# EAGLE board EasyCheck_rev1 (EAGLE 9.4.0)
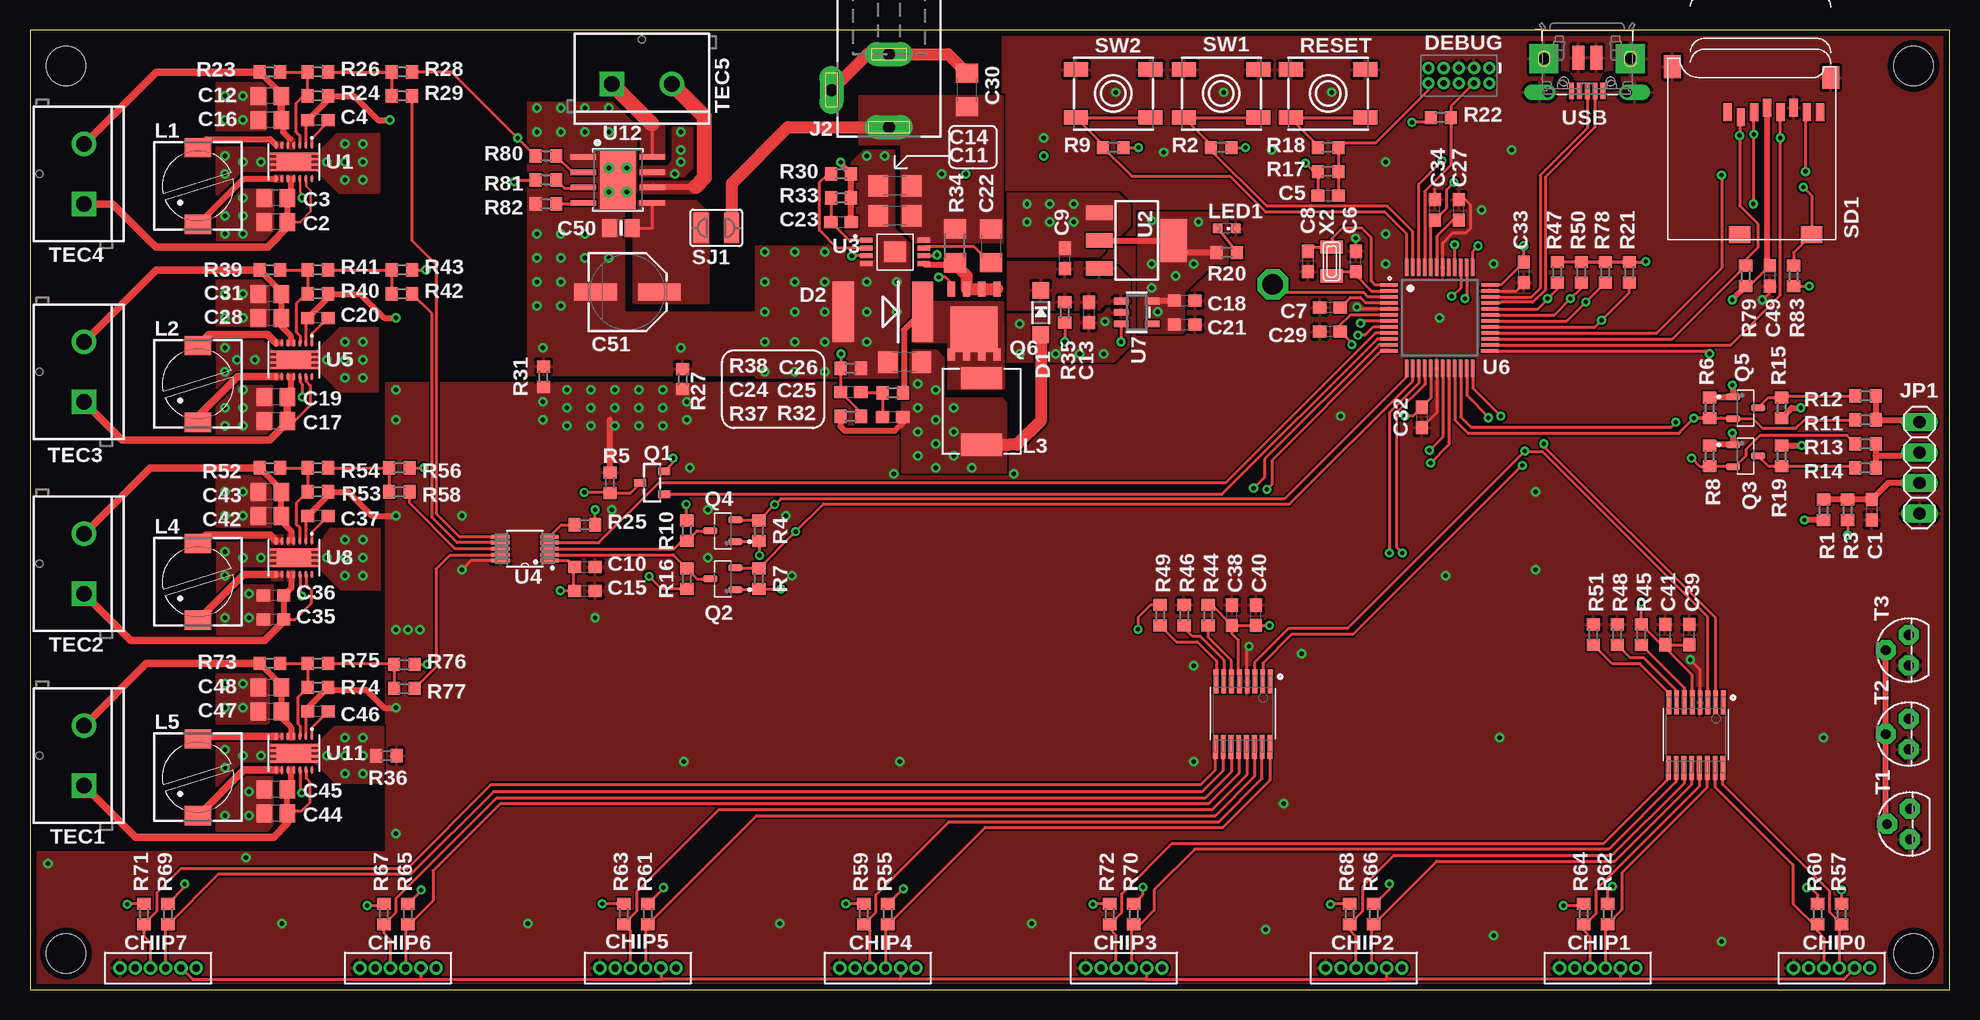
[diagram p2: board, top side]
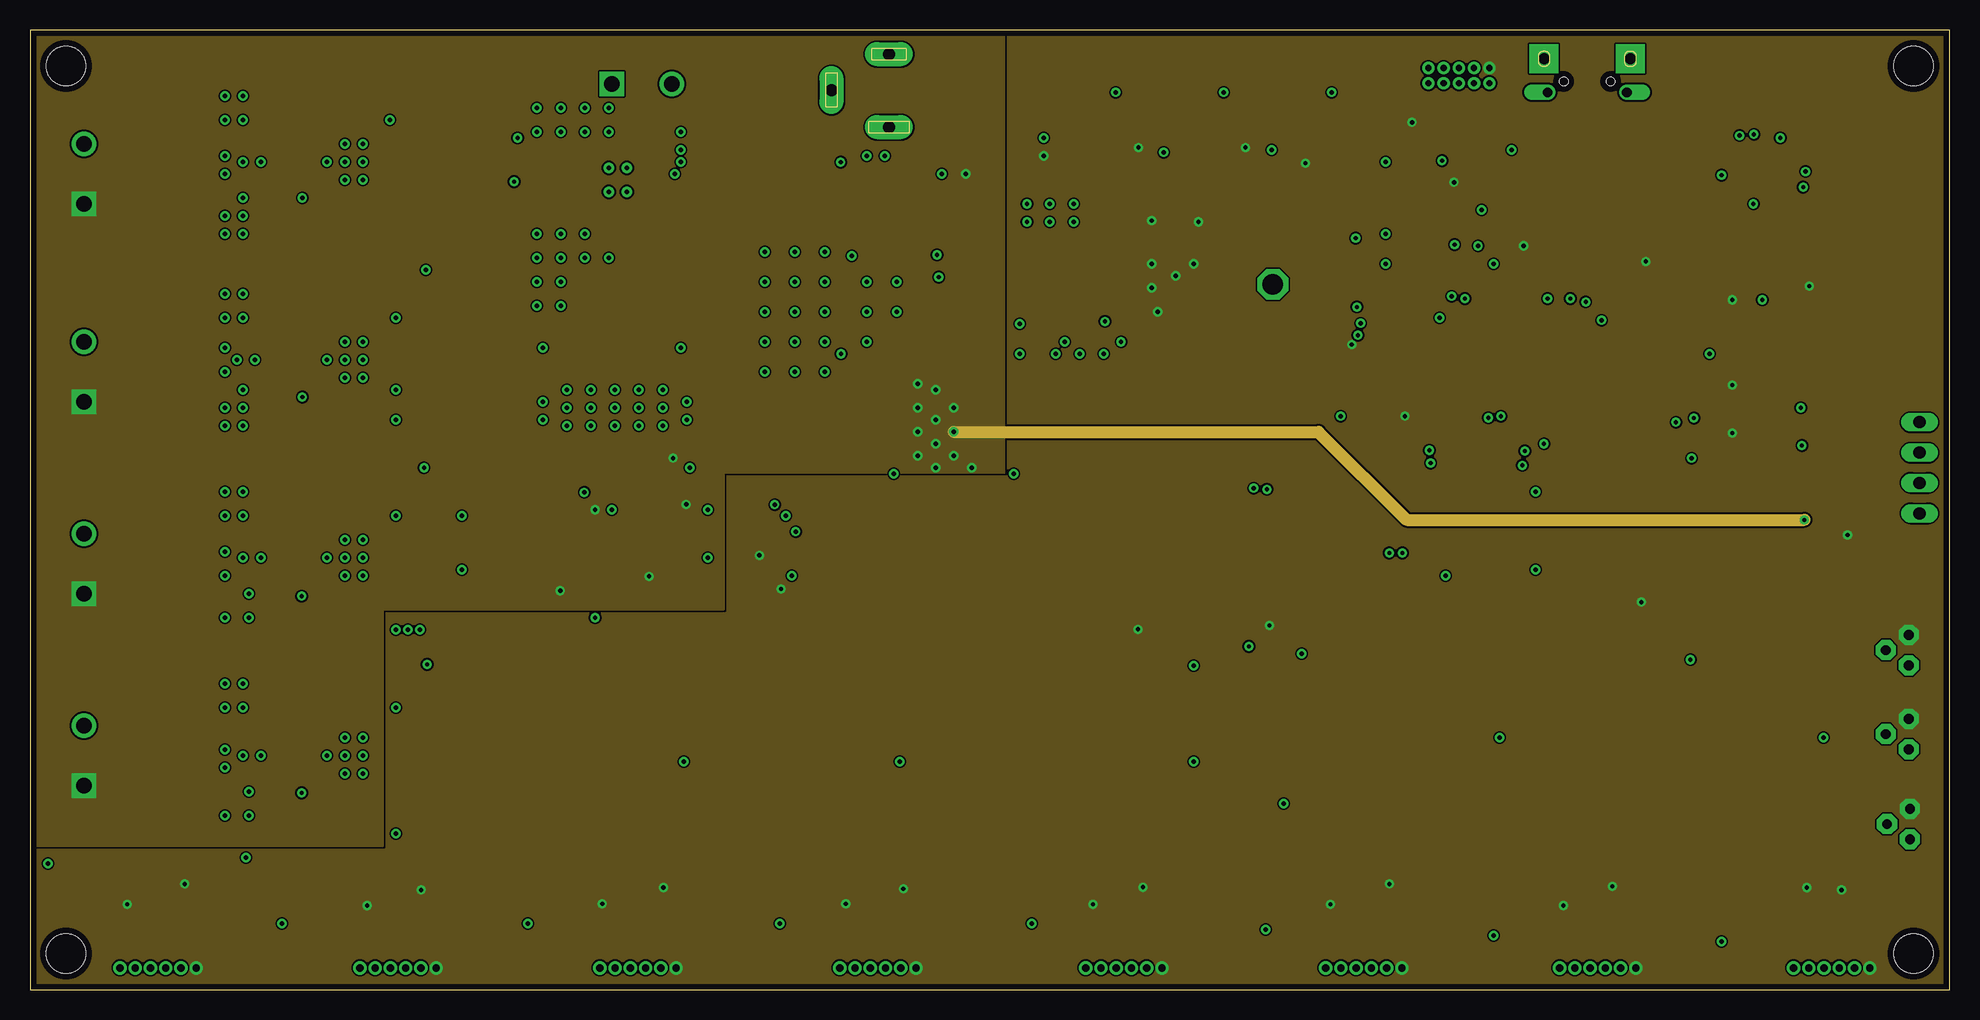
[diagram p3: board, inner layer Layer2]
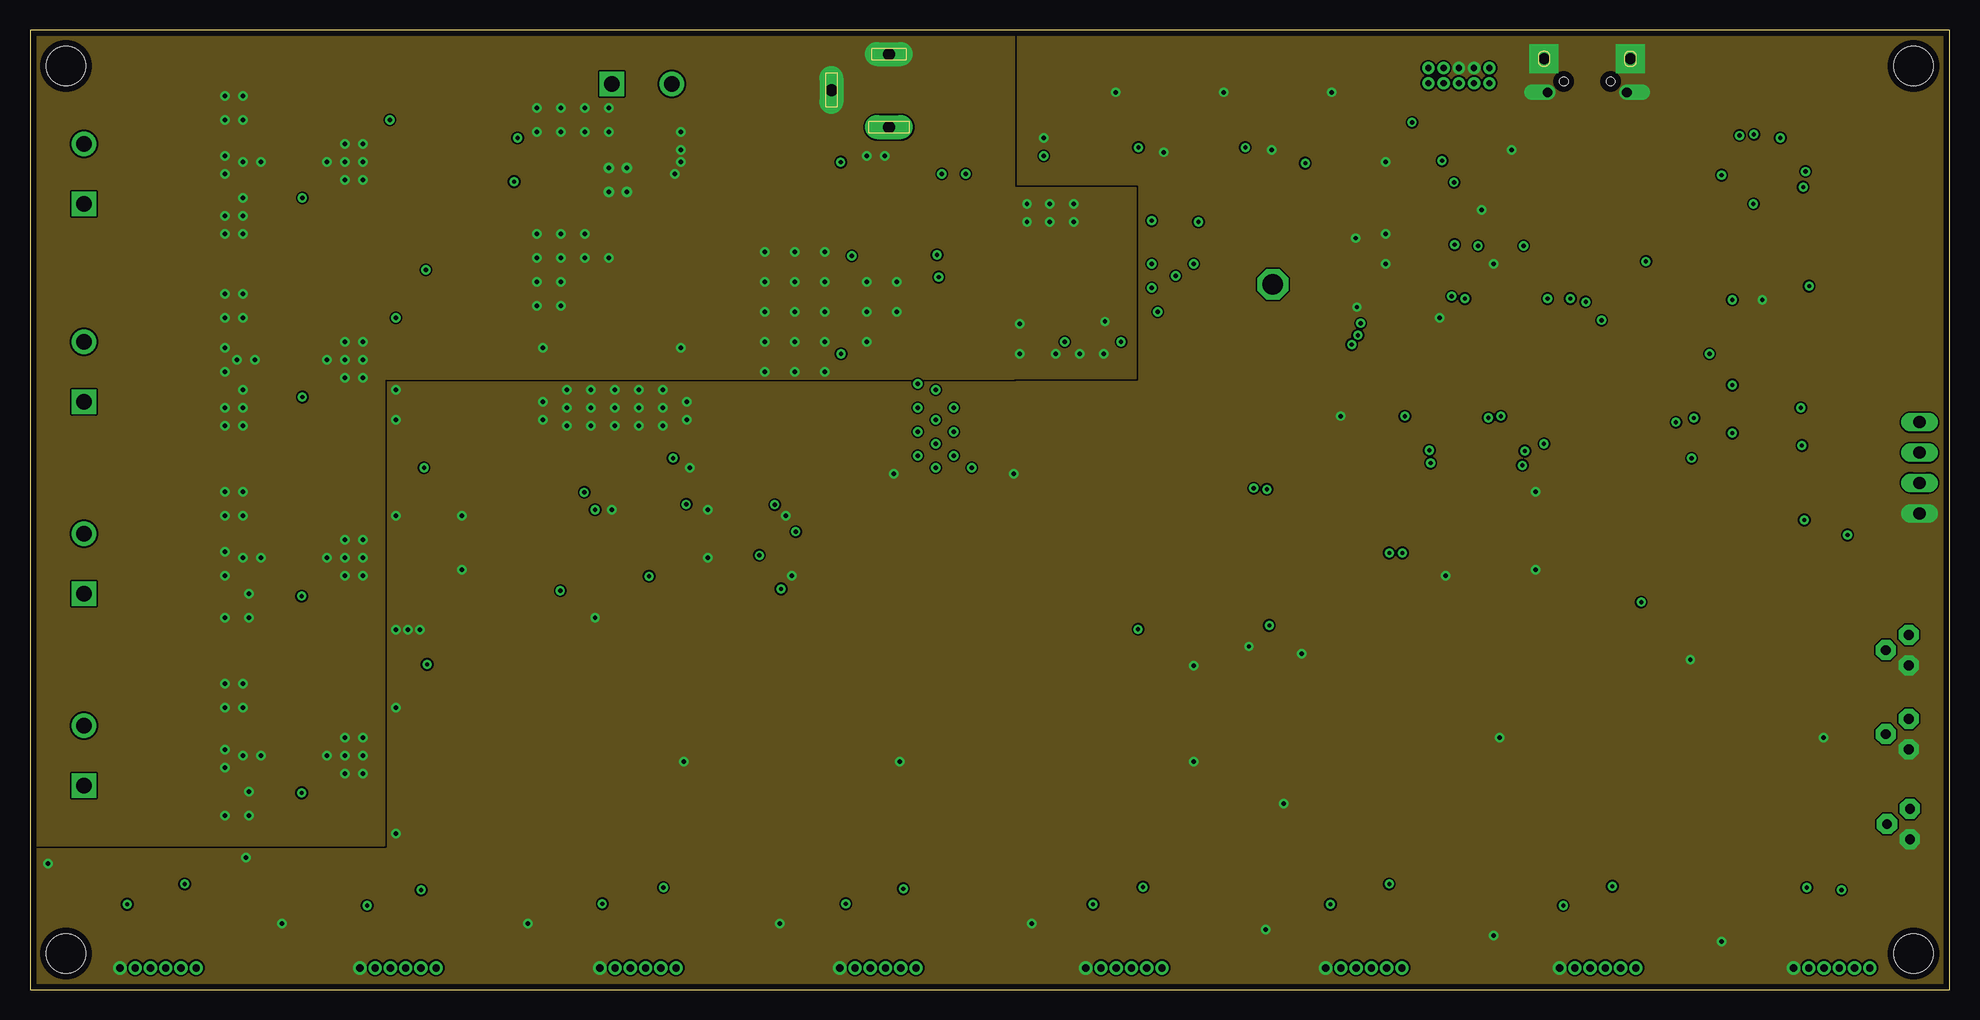
[diagram p4: board, inner layer Layer3]
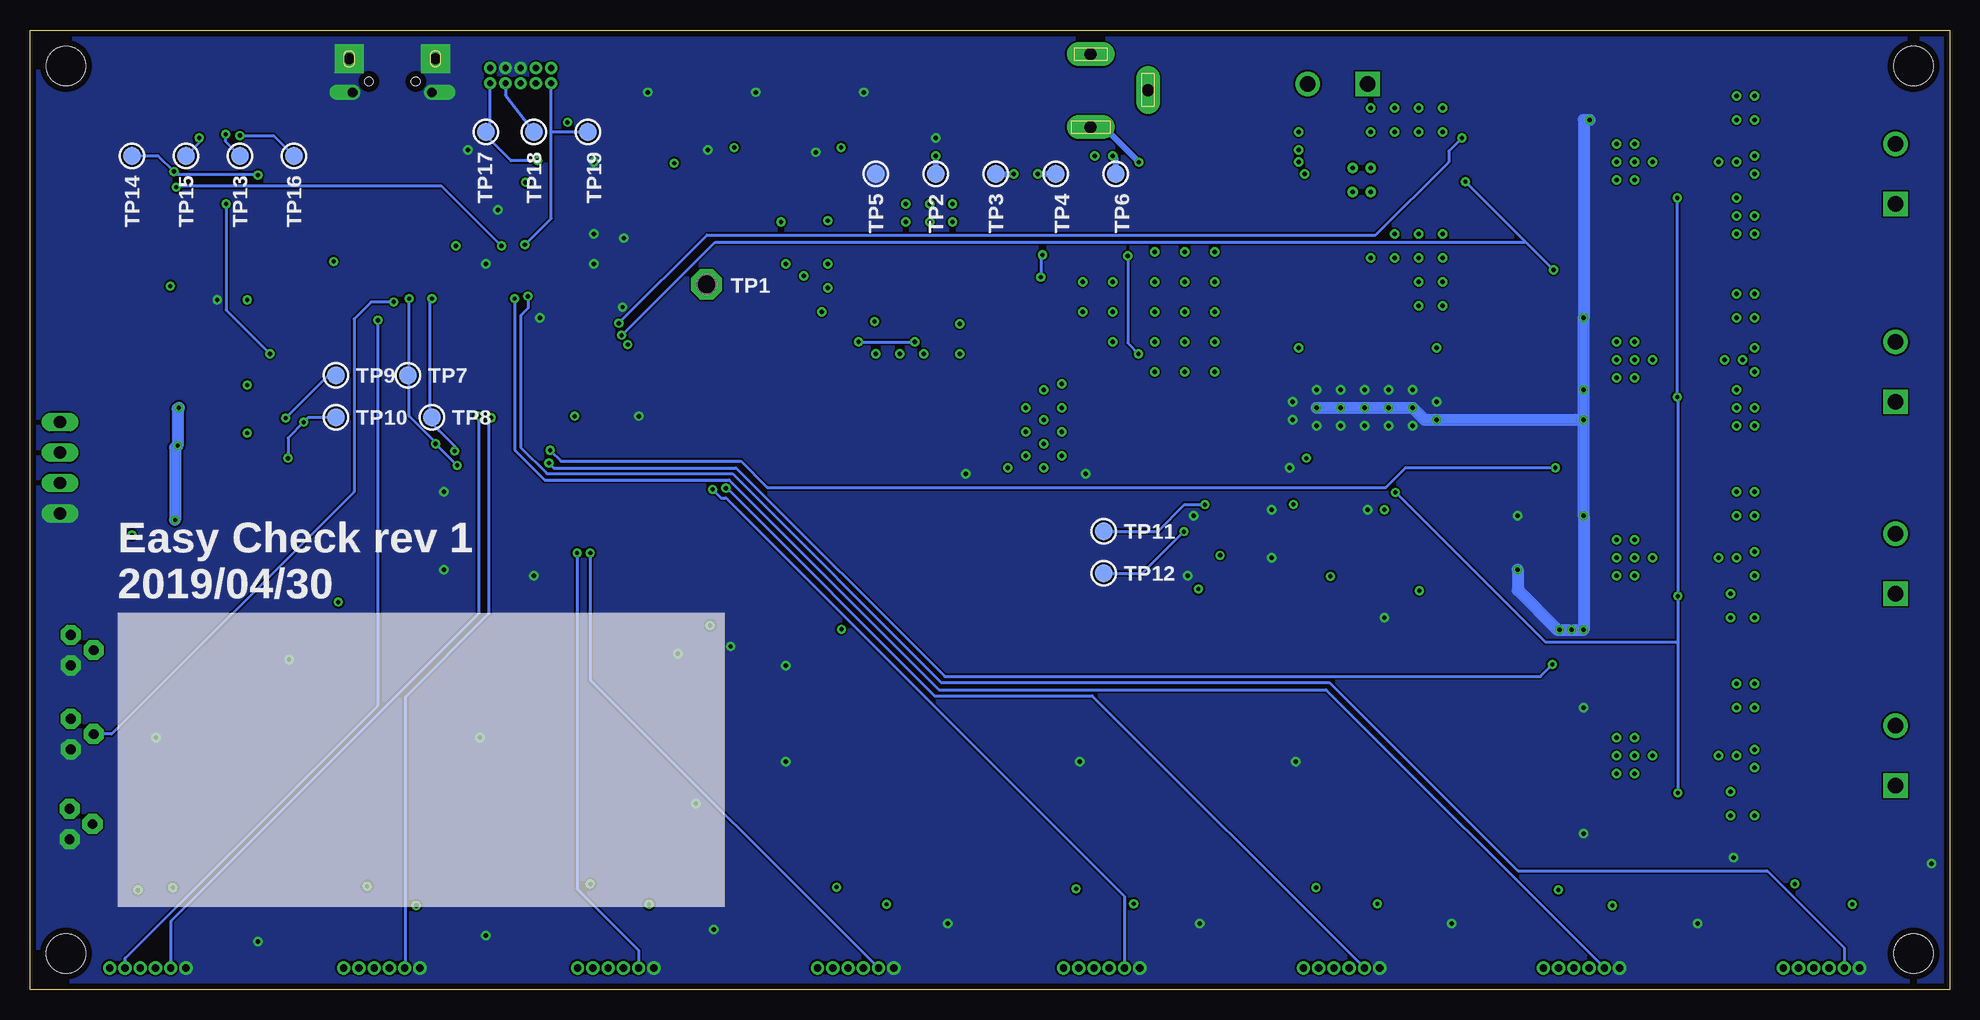
[diagram p5: board, bottom side, seen from below]

Size 160 x 80 mm. Coordinates in mm from the lower left corner, seen from the top.
Outline: 0,0 160,0 160,80 0,80 0,0
Copper layers (1+2*15+16): Top 0.035mm / dielectric 0.18mm / Layer2 0.035mm / dielectric 1.12mm / Layer3 0.035mm / dielectric 0.18mm / Bottom 0.035mm
Design rules "default *": minimum track width 6mil, minimum drill 0.35mm, track to track 6mil, track to pad 6mil, pad to pad 6mil, via to via 6mil, smd to smd 6mil, copper to edge 20mil, drill to drill 6mil, minimum pad ring 10mil, minimum via ring 8mil, stop-mask expansion 4mil, vias tented up to drill 0.4mm, thermal gap 10mil
Holes 3.3 mm at 3,3 3,77 157,3 157,77

## Footprints (pad centres in the part's own frame; a part is rotated, then mirrored left to right if it is on the bottom)
C0603 = smd 1.1 x 1: 1 -0.85,0; 2 0.85,0
C0805 = smd 1.3 x 1.5: 1 -0.95,0; 2 0.95,0
0603-NO = smd 1.1 x 1: 1 -0.85,0; 2 0.85,0
C1206 = smd 1.6 x 1.8: 1 -1.4,0; 2 1.4,0
0805-NO = smd 1.24 x 1.5: 1 -0.95,0; 2 0.95,0
PANASONIC_D = smd 3.556 x 1.4: + 2.654,0; - -2.654,0
6X1PIN_1.27 = drill 0.6: 1 0,0; 2 1.27,0; 3 2.54,0; 4 3.81,0; 5 5.08,0; 6 6.35,0
MICROBUILDER_SOD-123 = smd 1.4 x 1.4: A 1.85,0; C -1.85,0
SK104 = smd 1.778 x 5.08: 1 -3.302,0; 2 3.302,0
2X5-PTH-1.27MM = drill 0.508 pad 1: 1 -2.54,-0.635; 2 -2.54,0.635; 3 -1.27,-0.635; 4 -1.27,0.635; 5 0,-0.635; 6 0,0.635; 7 1.27,-0.635; 8 1.27,0.635; 9 2.54,-0.635; 10 2.54,0.635
DCJ0303 = drill 1 pad 2 long: 1 0,3.1; 2 4.8,0; 3 0,-3
1X04 = drill 1.016 long: 1 -3.81,0; 2 -1.27,0; 3 1.27,0; 4 3.81,0
PIS2816 = smd 2.2 x 1.6: 1 0,3.2; 2 0,-3.2
SPM6530T-4R7M = smd 1.85 x 3.4: 1 -2.775,0; 2 2.775,0
CHIPLED_0603 = smd 0.8 x 0.8: A 0,-0.75; C 0,0.75
MICROBUILDER_SOT23-R = smd 0.635 x 1.016: 1 -0.95,-1; 2 0.95,-1; 3 0,1
SOT91P240X110-3N = smd 1.18 x 0.61: 1 -1.025,0.915; 2 -1.025,-0.915; 3 1.025,0
SI7465 = smd 1.27 x 0.61: 1 0,1.905; 2 0,0.635; 3 0,-0.635; 4 0,-1.905 | smd 1.02 x 0.61: 5 5.465,-1.905; 6 5.465,-0.635; 7 5.465,0.635; 8 5.465,1.905 | smd 3.81 x 3.91: 9 3.36,0
R0603 = smd 1 x 1.1: 1 -0.85,0; 2 0.85,0
R1206 = smd 1.6 x 1.803: 1 -1.422,0; 2 1.422,0
MICROBUILDER_EVQ-Q2_SMALLER = smd 2 x 1.2: A -3.1,-2; A' 3.1,-2; B -3.1,2; B' 3.1,2
MICROSD = smd 0.7 x 1.5: 1 9,-10.64; 2 7.9,-10.24; 3 6.8,-10.64; 4 5.7,-11.04; 5 4.6,-10.64; 6 3.5,-11.04; 7 2.4,-10.64; 8 1.3,-10.64 | smd 1.8 x 1.4: CD1 2,-0.44; CD2 8,-0.44 | smd 1.4 x 1.9: MT1 0.4,-13.54; MT2 13.6,-14.44
SJW = smd 1.27 x 2.54: 1 -1.27,0; 2 1.27,0
TO92 = drill 0.813 pad 1.676 octagon: 1 -1.27,0; 2 0,1.905; 3 1.27,0
SPARKFUN-CONNECTORS_SCREWTERMINAL-5MM-2$1 = drill 1.3 pad 2.032 square: 1 0,0 | drill 1.3 pad 2.032: 2 5,0
P1-17 = drill 1.702 pad 2.54 octagon: TP 0,0
MICROBUILDER_TESTPOINT_ROUND_1.5MM = smd 1.5 x 1.5: P$1 0,0
QFN14-3X4MM = smd 0.6 x 0.24: 1 -1.4,1.5; 2 -1.4,1; 3 -1.4,0.5; 4 -1.4,0; 5 -1.4,-0.5; 6 -1.4,-1; 7 -1.4,-1.5; 8 1.4,-1.5; 9 1.4,-1; 10 1.4,-0.5; 11 1.4,0; 12 1.4,0.5; 13 1.4,1; 14 1.4,1.5 | smd 1.58 x 2.85: 15 0,0 | smd 0.2 x 0.575: 16 -0.69,1.712; 17 -0.23,1.712; 18 0.23,1.712; 19 0.69,1.712; 20 0.69,-1.712; 21 0.23,-1.712; 22 -0.23,-1.712; 23 -0.69,-1.712
GEN_COMP_SOT223 = smd 1.219 x 2.235: 1 -2.311,-3.099; 2 0,-3.099; 3 2.311,-3.099 | smd 3.6 x 2.2: 4 0,3.099
LM5085 = smd 0.41 x 1.02: 1 -0.975,-2.4; 2 -0.325,-2.4; 3 0.325,-2.4; 4 0.975,-2.4; 5 0.975,2.4; 6 0.325,2.4; 7 -0.325,2.4; 8 -0.975,2.4 | smd 1.73 x 1.85: 9 0,0
SOP50P490X110-10N = smd 1.524 x 0.33: 1 -2.032,0.991; 2 -2.032,0.508; 3 -2.032,0; 4 -2.032,-0.508; 5 -2.032,-0.991; 6 2.032,-0.991; 7 2.032,-0.508; 8 2.032,0; 9 2.032,0.508; 10 2.032,0.991
QFP50P900X900X120-48N = smd 1.45 x 0.3: 1 -4.2,2.75; 2 -4.2,2.25; 3 -4.2,1.75; 4 -4.2,1.25; 5 -4.2,0.75; 6 -4.2,0.25; 7 -4.2,-0.25; 8 -4.2,-0.75; 9 -4.2,-1.25; 10 -4.2,-1.75; 11 -4.2,-2.25; 12 -4.2,-2.75; 25 4.17,-2.75; 26 4.2,-2.25; 27 4.2,-1.75; 28 4.2,-1.25; 29 4.2,-0.75; 30 4.2,-0.25; 31 4.2,0.25; 32 4.2,0.75; 33 4.2,1.25; 34 4.2,1.75; 35 4.2,2.25; 36 4.2,2.75 | smd 0.3 x 1.45: 13 -2.75,-4.2; 14 -2.25,-4.2; 15 -1.75,-4.2; 16 -1.25,-4.2; 17 -0.75,-4.2; 18 -0.25,-4.2; 19 0.25,-4.2; 20 0.75,-4.2; 21 1.25,-4.2; 22 1.75,-4.2; 23 2.25,-4.2; 24 2.75,-4.2; 37 2.75,4.2; 38 2.25,4.2; 39 1.75,4.2; 40 1.25,4.2; 41 0.75,4.2; 42 0.25,4.2; 43 -0.25,4.2; 44 -0.75,4.2; 45 -1.25,4.2; 46 -1.75,4.2; 47 -2.25,4.2; 48 -2.75,4.2
MICROBUILDER_SOT23-5 = smd 0.55 x 1.2: 1 -0.95,-1.3; 2 0,-1.3; 3 0.95,-1.3; 4 0.95,1.3; 5 -0.95,1.3
ADC128D818 = smd 0.4 x 2: 1 -2.3,-2.7; 2 -1.65,-2.7; 3 -1,-2.7; 4 -0.35,-2.7; 5 0.3,-2.7; 6 0.95,-2.7; 7 1.6,-2.7; 8 2.25,-2.7; 9 2.3,2.75; 10 1.65,2.75; 11 1,2.75; 12 0.35,2.75; 13 -0.3,2.75; 14 -0.95,2.75; 15 -1.6,2.75; 16 -2.25,2.75
HSOP8 = smd 0.45 x 2.15: 1 -1.905,-2.875; 2 -0.635,-2.875; 3 0.635,-2.875; 4 1.905,-2.875; 5 1.905,2.875; 6 0.635,2.875; 7 -0.635,2.875; 8 -1.905,2.875 | smd 4.9 x 2.95: GND 0,0 | drill 0.4: P$1 -1,0.75; P$2 -1,-0.75; P$3 1,-0.75; P$4 1,0.75
MICROBUILDER_4UCONN_20329_V2 = smd 1 x 2: BASE@1 -0.75,-2; BASE@2 0.75,-2 | smd 0.4 x 1.35: D+ 0,0.775; D- -0.65,0.775; GND 1.3,0.775; ID 0.65,0.775; VBUS -1.3,0.775 | drill 0.8 pad 1.143 offset: SPRT@1 -3.3,0.9; SPRT@2 3.3,0.9 | drill 0.9 pad 2.413 square: SPRT@3 -3.6,-1.9; SPRT@4 3.6,-1.9 | hole 0.7: -1.95,0; 1.95,0
XTAL3215 = smd 1.1 x 1.9: P$1 1.2,0; P$2 -1.2,0

## Placement (x,y rotation side)
C1  0.1uF  [C0603]  153.5,40 270 top
C2  10uF  [C0805]  20.5,64 180 top
C3  2.2uF  [C0805]  20.5,66 180 top
C4  0.1uF  [C0603]  24,72.5 180 top
C5  0.1nF  [C0603]  108.2,66.2 0 top
C6  22pF  [0603-NO]  110.5,60.7 90 top
C7  1uF  [C0603]  108.35,56.85 180 top
C8  22pF  [0603-NO]  106.5,60.7 270 top
C9  10uF  [C0603]  86.25,60.95 90 top
C10  10uF  [C0603]  46.25,35.25 0 top
C11  47uF  [C1206]  72.1,64.5 180 top
C12  2.2uF  [C0805]  20,74.5 180 top
C13  0.1uF  [C0603]  88.25,56.45 270 top
C14  1uF  [C1206]  72.1,67 180 top
C15  0.1uF  [C0603]  46.25,33.25 0 top
C16  10uF  [C0805]  20,72.5 180 top
C17  10uF  [C0805]  20.5,47.4 180 top
C18  10uF  [C0603]  96.25,57.45 0 top
C19  2.2uF  [C0805]  20.5,49.4 180 top
C20  0.1uF  [C0603]  24,56 180 top
C21  0.1uF  [C0603]  96.25,55.45 0 top
C22  0.47uF  [C1206]  80.1,62 270 top
C23  1nF  [C0603]  67.6,64 0 top
C24  100nF  [C0603]  68.4,49.8 180 top
C25  3.3nF  [C0603]  71.9,47.75 0 top
C26  100uF  [C1206]  72.9,52.3 180 top
C27  1uF  [C0603]  119.1,65 90 top
C28  2.2uF  [C0805]  20,56 180 top
C29  10uF  [C0603]  108.35,54.85 180 top
C30  10uF 25v  [C1206]  78.1,75 90 top
C31  10uF  [C0805]  20,58 180 top
C32  0.1uF  [C0603]  116,47.7 270 top
C33  0.1uF  [C0603]  124.5,59.8 270 top
C34  0.1uF  [C0603]  117.1,65 90 top
C35  10uF  [C0603]  20.3,30.85 180 top
C36  2.2uF  [C0603]  20.3,32.85 180 top
C37  0.1uF  [C0603]  24,39.5 180 top
C38  0.1uF  [C0603]  100.2,31.2 90 top
C39  0.1uF  [C0603]  138.3,29.6 90 top
C40  1uF  [C0603]  102.2,31.2 90 top
C41  1uF  [C0603]  136.3,29.6 90 top
C42  2.2uF  [C0805]  20,39.5 180 top
C43  10uF  [C0805]  20,41.5 180 top
C44  10uF  [C0805]  20.5,14.7 180 top
C45  2.2uF  [C0805]  20.5,16.7 180 top
C46  0.1uF  [C0603]  24,23.2 180 top
C47  2.2uF  [C0805]  20,23.2 180 top
C48  10uF  [C0805]  20,25.2 180 top
C49  1uF  [C0603]  145,59.5 270 top
C50  0.1uF/50V  [0805-NO]  49.25,63.5 180 top
C51  22uF/63V  [PANASONIC_D]  49.8,58.15 0 top
CHIP0  6PIN_1.27  [6X1PIN_1.27]  147,1.8 0 top
CHIP1  6PIN_1.27  [6X1PIN_1.27]  127.5,1.8 0 top
CHIP2  6PIN_1.27  [6X1PIN_1.27]  108,1.8 0 top
CHIP3  6PIN_1.27  [6X1PIN_1.27]  88,1.8 0 top
CHIP4  6PIN_1.27  [6X1PIN_1.27]  67.5,1.8 0 top
CHIP5  6PIN_1.27  [6X1PIN_1.27]  47.5,1.8 0 top
CHIP6  6PIN_1.27  [6X1PIN_1.27]  27.5,1.8 0 top
CHIP7  6PIN_1.27  [6X1PIN_1.27]  7.5,1.8 0 top
D1  MBR120  [MICROBUILDER_SOD-123]  84.25,56.45 270 top
D2  SK104  [SK104]  71.1,56.5 0 top
DEBUG  CORTEX_DEBUG_PTH  [2X5-PTH-1.27MM]  119.1,76.2 180 top
J2  [DCJ0303]  71.6,75 180 top
JP1  [1X04]  157.5,43.5 270 top
L1  FXC0630-1R5M  [PIS2816]  14,67 180 top
L2  FXC0630-1R5M  [PIS2816]  14,50.5 180 top
L3  SPM6530T-4R7M  [SPM6530T-4R7M]  79.3,48.2 270 top
L4  FXC0630-1R5M  [PIS2816]  14,34 180 top
L5  FXC0630-1R5M  [PIS2816]  14,17.7 180 top
LED1  [CHIPLED_0603]  99.75,63.45 270 top
Q1  [MICROBUILDER_SOT23-R]  51.85,42.25 90 top
Q2  [SOT91P240X110-3N]  57.75,34.25 180 top
Q3  [SOT91P240X110-3N]  143,44.5 0 top
Q4  [SOT91P240X110-3N]  57.75,38.25 180 top
Q5  [SOT91P240X110-3N]  143,48.5 0 top
Q6  SI7465DP  [SI7465]  78.7,58.4 270 top
R1  DNP  [R0603]  149.5,40 90 top
R2  4.7k  [R0603]  99.3,70.2 0 top
R3  0  [R0603]  151.5,40 90 top
R4  4.7k  [R0603]  60.75,38.25 270 top
R5  10k  [R0603]  48.35,42.25 270 top
R6  4.7k  [R0603]  140,48.5 90 top
R7  4.7k  [R0603]  60.75,34.25 270 top
R8  4.7k  [R0603]  140,44.5 90 top
R9  4.7k  [R0603]  90.3,70.2 0 top
R10  4.7k  [R0603]  54.75,38.25 90 top
R11  0  [R0603]  153,47.5 180 top
R12  DNP  [R0603]  153,49.5 180 top
R13  0  [R0603]  153,45.5 180 top
R14  DNP  [R0603]  153,43.5 180 top
R15  4.7k  [R0603]  146,48.5 270 top
R16  4.7k  [R0603]  54.75,34.25 270 top
R17  2.2k  [R0603]  108.2,68.2 180 top
R18  330  [R0603]  108.2,70.2 0 top
R19  4.7k  [R0603]  146,44.5 90 top
R20  68  [R0603]  99.75,61.45 180 top
R21  1k  [R0603]  133.3,59.8 90 top
R22  1k  [R0603]  117.6,72.7 180 top
R23  1M  [R0603]  20,76.5 180 top
R24  130k  [R0603]  24,74.5 180 top
R25  100k  [R0603]  46.25,38.75 0 top
R26  750k  [R0603]  24,76.5 180 top
R27  0  [R0603]  54.4,50.9 270 top
R28  0  [R0603]  31,76.5 180 top
R29  0  [R0603]  31,74.5 180 top
R30  24k  [R0603]  67.6,68 0 top
R31  0  [R0603]  42.8,51.1 270 top
R32  66.5k  [R0603]  71.9,49.75 0 top
R33  200R  [R0603]  67.6,66 180 top
R34  0.001ohm  [R1206]  77.1,62 270 top
R35  100k  [R0603]  86.25,56.45 270 top
R36  0  [R0603]  29.7,19.5 0 top
R37  10k  [R0603]  68.4,47.8 0 top
R38  3.4k  [R0603]  68.4,51.8 0 top
R39  1M  [R0603]  20,60 180 top
R40  130k  [R0603]  24,58 180 top
R41  750k  [R0603]  24,60 180 top
R42  0  [R0603]  31,58 180 top
R43  0  [R0603]  31,60 180 top
R44  4.7k  [R0603]  98.2,31.2 90 top
R45  4.7k  [R0603]  134.3,29.6 90 top
R46  10k  [R0603]  96.2,31.2 270 top
R47  4.7k  [R0603]  127.3,59.8 90 top
R48  10k  [R0603]  132.3,29.6 270 top
R49  10k  [R0603]  94.2,31.2 270 top
R50  4.7k  [R0603]  129.3,59.8 90 top
R51  10k  [R0603]  130.3,29.6 270 top
R52  1M  [R0603]  20,43.5 180 top
R53  130k  [R0603]  24,41.5 180 top
R54  750k  [R0603]  24,43.5 180 top
R55  10k, 1%  [R0603]  71.5,6.3 90 top
R56  DNP  [R0603]  30.8,43.5 180 top
R57  10k, 1%  [R0603]  151,6.3 90 top
R58  0  [R0603]  30.8,41.5 180 top
R59  TBD, 1%  [R0603]  69.5,6.3 90 top
R60  TBD, 1%  [R0603]  149,6.3 90 top
R61  10k, 1%  [R0603]  51.5,6.3 90 top
R62  10k, 1%  [R0603]  131.5,6.3 90 top
R63  TBD, 1%  [R0603]  49.5,6.3 90 top
R64  TBD, 1%  [R0603]  129.5,6.3 90 top
R65  10k, 1%  [R0603]  31.5,6.3 90 top
R66  10k, 1%  [R0603]  112,6.3 90 top
R67  TBD, 1%  [R0603]  29.5,6.3 90 top
R68  TBD, 1%  [R0603]  110,6.3 90 top
R69  10k, 1%  [R0603]  11.5,6.3 90 top
R70  10k, 1%  [R0603]  92,6.3 90 top
R71  TBD, 1%  [R0603]  9.5,6.3 90 top
R72  TBD, 1%  [R0603]  90,6.3 90 top
R73  1M  [R0603]  20,27.2 180 top
R74  130k  [R0603]  24,25.2 180 top
R75  750k  [R0603]  24,27.2 180 top
R76  0  [R0603]  31.2,27.1 180 top
R77  0  [R0603]  31.2,25.1 180 top
R78  4.7k  [R0603]  131.3,59.8 90 top
R79  10k  [R0603]  143,59.5 270 top
R80  0  [R0603]  43,69.5 0 top
R81  0  [R0603]  43,67.5 0 top
R82  30k  [R0603]  43,65.5 180 top
R83  10k  [R0603]  147,59.5 270 top
RESET  [MICROBUILDER_EVQ-Q2_SMALLER]  108.2,74.7 0 top
SD1  MICROSD  [MICROSD]  150.5,62.5 180 top
SJ1  [SJW]  57.2,63.5 180 top
SW1  [MICROBUILDER_EVQ-Q2_SMALLER]  99.3,74.7 0 top
SW2  [MICROBUILDER_EVQ-Q2_SMALLER]  90.3,74.7 0 top
T1  DS18B20  [TO92]  156.7,13.8 90 top
T2  DS18B20  [TO92]  156.6,21.3 90 top
T3  DS18B20  [TO92]  156.6,28.3 90 top
TEC1  [SPARKFUN-CONNECTORS_SCREWTERMINAL-5MM-2$1]  4.5,17 90 top
TEC2  [SPARKFUN-CONNECTORS_SCREWTERMINAL-5MM-2$1]  4.5,33 90 top
TEC3  [SPARKFUN-CONNECTORS_SCREWTERMINAL-5MM-2$1]  4.5,49 90 top
TEC4  [SPARKFUN-CONNECTORS_SCREWTERMINAL-5MM-2$1]  4.5,65.5 90 top
TEC5  [SPARKFUN-CONNECTORS_SCREWTERMINAL-5MM-2$1]  48.5,75.5 0 top
TP1  TPPAD1-17  [P1-17]  103.6,58.8 270 bottom
TP2  [MICROBUILDER_TESTPOINT_ROUND_1.5MM]  84.5,68 270 bottom
TP3  [MICROBUILDER_TESTPOINT_ROUND_1.5MM]  79.5,68 270 bottom
TP4  [MICROBUILDER_TESTPOINT_ROUND_1.5MM]  74.5,68 270 bottom
TP5  [MICROBUILDER_TESTPOINT_ROUND_1.5MM]  89.5,68 270 bottom
TP6  [MICROBUILDER_TESTPOINT_ROUND_1.5MM]  69.5,68 270 bottom
TP7  [MICROBUILDER_TESTPOINT_ROUND_1.5MM]  128.5,51.2 0 bottom
TP8  [MICROBUILDER_TESTPOINT_ROUND_1.5MM]  126.5,47.7 0 bottom
TP9  [MICROBUILDER_TESTPOINT_ROUND_1.5MM]  134.5,51.2 0 bottom
TP10  [MICROBUILDER_TESTPOINT_ROUND_1.5MM]  134.5,47.7 0 bottom
TP11  [MICROBUILDER_TESTPOINT_ROUND_1.5MM]  70.5,38.2 0 bottom
TP12  [MICROBUILDER_TESTPOINT_ROUND_1.5MM]  70.5,34.7 0 bottom
TP13  [MICROBUILDER_TESTPOINT_ROUND_1.5MM]  142.5,69.5 270 bottom
TP14  [MICROBUILDER_TESTPOINT_ROUND_1.5MM]  151.5,69.5 270 bottom
TP15  [MICROBUILDER_TESTPOINT_ROUND_1.5MM]  147,69.5 270 bottom
TP16  [MICROBUILDER_TESTPOINT_ROUND_1.5MM]  138,69.5 270 bottom
TP17  [MICROBUILDER_TESTPOINT_ROUND_1.5MM]  122,71.5 90 bottom
TP18  [MICROBUILDER_TESTPOINT_ROUND_1.5MM]  118,71.5 270 bottom
TP19  [MICROBUILDER_TESTPOINT_ROUND_1.5MM]  113.5,71.5 270 bottom
U1  TPS63020  [QFN14-3X4MM]  22,69 270 top
U2  AP2114H-3.3V- 1A  [GEN_COMP_SOT223]  92.25,62.45 270 top
U3  LM5085  [LM5085]  72.1,61.5 270 top
U4  MCP4728-E/UN  [SOP50P490X110-10N]  41.25,36.75 180 top
U5  TPS63020  [QFN14-3X4MM]  22,52.5 270 top
U6  ATSAMD21G18A-AU  [QFP50P900X900X120-48N]  117.5,56 0 top
U7  SPX3819_3.3V  [MICROBUILDER_SOT23-5]  92.25,56.45 270 top
U8  TPS63020  [QFN14-3X4MM]  22,36 270 top
U9  LMD128D818  [ADC128D818]  101.1,23 180 top
U10  LMD128D818  [ADC128D818]  138.85,21.25 180 top
U11  TPS63020  [QFN14-3X4MM]  22,19.7 270 top
U12  DRV8871  [HSOP8]  49,67.5 270 top
USB  [MICROBUILDER_4UCONN_20329_V2]  129.8,75.7 180 top
X2  32.768  [XTAL3215]  108.5,60.7 270 top

## Tracks (layer width: path | path; a pad name or v marks a point on that pad's centre or on a via)
1W_TEMP  (via drill 0.35)
  Top 0.254: U6.30 128.1,55.75 v129.68,57.33 R78.1
  Top 0.508: T1.2 154.69,13.9 T2.2 T3.2
  Bottom 0.254: v129.68,57.33 131.57,57.33 133,55.9 133,41.5 153.2,21.3 T2.2
+3V3  (via drill 0.35)
  Top 0.254: Q4.1 60.69,37.34 R4.2 60.75,36.25 v60.8,36.2 | Q2.1 60.69,33.34 R7.2 v62.6,33.4 | U6.36 122.2,58.75 122.6,58.75 C33.1 v124.5,62 | U10.5 138.55,26.25 136.05,28.75 136.2,28.75 | 136.2,28.75 C41.1 C39.1 | 136.2,28.75 136,28.75 R45.2 v134.3,32.3 | 99.9,30.35 C38.1 | C38.1 100.2,29.65 100.7,29.15 100.7,28.6 100.7,25.8 U9.5 | C38.1 C40.1 v103.3,30.35 | C38.1 98.5,32.05 R44.2 | 141.97,46.33 v141.9,46.4 | 141.97,50.33 v141.9,50.4 | C49.1 143.3,58.65 R79.2 | R83.2 v148.3,58.65 | U6.17 116.75,49.3 C32.1 115.25,47.8 v114.6,47.8 | R9.2 v92.4,70.2 | R2.2 v101.3,70.2 | U6.44 116.75,63.8 C34.1 118.1,65.15 118.1,66.7 v118.7,67.3 | U6.6 110.05,56.25 109.2,55.4 C29.1 110.17,53.88 v110.17,53.77 | R49.1 93.4,32.05 92.36,31.02 v92.36,30.04 | R70.2 92.77,7.92 v92.77,8.54 | R72.2 88.65,7.15 v88.6,7.1 | R57.2 v151,8.3 | v148.1,8.5 148.4,8.5 149,7.9 R60.2 | R65.2 32.6,8.25 v32.6,8.3 | R61.2 52.8,8.45 v52.8,8.5 | R63.2 v47.7,7.15 | R69.2 12.9,8.55 v12.9,8.8 | R71.2 8.15,7.15 v8.1,7.1 | R67.2 29.35,7 v28.1,7 | R55.2 72.75,8.4 v72.8,8.4 | R59.2 v68,7.15 | R68.2 108.45,7.15 v108.4,7.1 | R66.2 112.1,7.15 113.12,8.18 113.3,8.35 v113.3,8.8 | R64.2 129.35,7 v127.8,7 | R62.2 131.5,8.2 v131.9,8.6 | R21.2 134.65,60.65 v134.7,60.7 | C5.1 R17.2 107,68.2 v106.3,68.9 | R22.2 116.35,72.3 v115.2,72.3 | R3.1 v151.5,37.9 | R21.2 131.5,60.65 | 131.5,60.65 R47.2 | R78.2 131.5,60.65 | 131.5,60.65 R21.2 | R50.2 131.5,60.65
  Top 0.508: U7.5 93.6,57.45 C18.1 95.35,57.5 | R20.2 96.35,61.45 95.53,62.27 | 95.53,62.27 U2.4 | U2.2 U2.4 | 95.53,62.27 U2.4 | Q3.1 141.97,45.5 | 141.97,45.5 141.97,46.33 | R6.2 140.06,49.41 Q5.1 141.97,50.33 | R8.2 140.15,45.5 141.97,45.5 | R79.2 141.9,57.55 v141.9,57.5 | C49.1 144.8,60.55 SD1.4
  Bottom 0.508: TP2.P$1 v84.5,69.5
  other vias: 93.5,64.1 93.5,60.5 97.4,64 97,60.5 95.5,59.5 93.5,58.5 94,56.5
  pour Top (no thermals): 92.4,64.8 99.8,64.8 99.8,60.5 98.6,60.5 96.2,58.1 96.2,54.9 96,54.7 92.4,54.7
  pour Layer2 (rank 2, no thermals): -4.1,82.8 162,82.8 162,-2.7 -4.1,-2.7
+5V  (via drill 0.35)
  Top 0.203: U1.13 23,67 23.4,66.6 23.4,64.9 22.5,64 21.7,64 C2.1
  Top 0.254: U5.13 23,50.73 23.36,50.37 23.36,48.71 22,47.35 21.5,47.35 C17.1 21.45,47.25 | U8.13 23,33.75 23.45,33.3 23.45,32.2 22.05,30.8 21.15,30.8 | U11.13 23,17.63 23.35,17.28 23.35,15.6 22.65,14.9 21.65,14.9 C44.1 | 21.75,18.3 U11.10 | U8.11 21.82,34.6 21.77,34.65 | U4.1 44.89,35.76 45.33,35.33 | 45.33,35.33 C10.1 | 45.33,35.33 45.33,33.33 C15.1 v44.2,33.25 | v54.7,40.45 54.7,39.15 R10.2 | R16.2 52.65,33.4 v51.6,34.45 | Q1.2 53.6,43.95 v53.6,44.3 | R25.2 v47.1,40
  Top 0.508: C2.1 C3.1 21.75,66.3 21.75,67.6 | 21.77,34.65 21.77,33.47 C36.1 21.15,30.8 | C19.1 21.75,49.7 21.75,51.1 | 21.75,18.3 21.75,17 C45.1 C44.1 | R15.2 146.85,48.5 v147.6,48.5 | R19.2 v147.7,45.35 | R1.1 v147.9,39.15 | R37.1 67.55,46.95 67.9,46.6 72.1,46.6 72.75,47.25 C25.2
  Top 0.61: TEC4.1 6.9,65.5 9.9,62.5 10.5,61.9 19.8,61.9 21.7,63.8 21.7,64 | TEC3.1 7.7,45.8 20,45.8 21.45,47.25 | C17.1 C19.1 | TEC2.1 8.4,29.1 19.55,29.1 21.15,30.7 21.15,30.8 C35.1 | TEC1.1 8.8,12.7 20.3,12.7 21.45,13.85 C44.1
  Top 1.016: L3.2 81.6,45.42 82.28,45.42 84.25,47.4 D1.A
  Layer2 1.016: v77,46.5 107.4,46.5 114.75,39.15 v147.9,39.15
  Bottom 0.508: TP3.P$1 v78,68
  Bottom 1.016: v147.6,48.5 147.7,48.4 v147.7,45.35 147.9,45.15 v147.9,39.15
  other vias: 74,50.5 75.5,50 77,48.5 74,48.5 74,46.5 74,44.5 77,44.5 75.5,47.5 75.5,45.5 75.5,43.5 78.5,43.5
  pour Top (no thermals): 21.45,34.9 21.45,34.1 22.05,34.1 22.05,34.9
  pour Top (no thermals): 21.45,67.9 22.05,67.9 22.05,67.3 21.45,67.3
  pour Top (no thermals): 21.5,51.4 22,51.4 22,50.8 21.5,50.8
  pour Top (no thermals): 21.5,18.6 22,18.6 22,18 21.5,18
  pour Layer2 (no thermals): -0.85,80.6 81.2,80.6 81.2,43.05 57.8,43.05 57.8,31.65 29.4,31.65 29.4,11.95 -0.85,11.95
  pour Top (no thermals): 73.65,53.3 75.55,53.3 76.15,52.7 76.15,49.3 81,49.3 81.35,48.95 81.35,43.05 72.7,43.05 72.7,52.35
+12V  (via drill 0.35)
  Top 0.508: C23.2 R33.1 R30.2 67.58,68.88 v67.58,68.97
  Top 1.016: SJ1.1 58.5,63.53 58.5,67.2 63.2,71.9 J2.1
  Bottom 0.508: v67.58,68.97 70.5,71.9 J2.1 | TP4.P$1 v76,68
  pour Top (no thermals): 69.1,70.5 72.6,70.5 72.6,63.5 73.8,62.3 81.1,62.3 81.1,74.5 69.1,74.5
/RESET  (via drill 0.35)
  Top 0.254: C5.2 R17.1 R18.2 109.45,70.6 112.2,70.6 116.56,74.96 DEBUG.10 | U6.40 v118.75,62.1
  Bottom 0.254: v118.75,62.1 116.56,64.29 116.56,71.5 | 116.56,71.5 DEBUG.10 | TP19.P$1 116.56,71.5
/SS  (via drill 0.35)
  Top 0.254: U6.27 136.9,54.25 R79.1 143,60.85 144,61.85 144,63.84 142.5,65.34 v142.5,71.2 142.5,72.64 SD1.2
  Bottom 0.254: TP16.P$1 139.7,71.2 v142.5,71.2
BTN_1
  Top 0.254: SW1.A' SW1.A 98.45,70.45 R2.1 98.45,69.95 103.11,65.3 113.15,65.3 115.25,63.2 U6.47
BTN_2
  Top 0.254: SW2.A' SW2.A 89.45,70.45 R9.1 91.85,67.8 100,67.8 103,64.8 112.95,64.8 114.75,63 U6.48
CARD_DETECT  (via drill 0.35)
  Top 0.254: R83.1 147,61.44 SD1.CD1 148.5,66.2 v147.8,66.9 | U6.37 120.25,61.55 v120.7,62
  Bottom 0.254: v120.7,62 125.7,67 147.7,67 v147.8,66.9
CHIP0_RES
  Top 0.254: CHIP0.3 149.54,3.3 149.54,4.3 149,4.84 149,5.1 | 149,5.1 R60.1 | 149,5.1 146.95,7.15 146.95,10.4 140.45,16.9 U10.15
CHIP0_STATUS  (via drill 0.35)
  Top 0.254: U6.24 120.25,50.15 v122.6,47.8
  Bottom 0.254: v122.6,47.8 122.6,31.37 148.27,5.7 CHIP0.2
CHIP0_TH
  Top 0.254: CHIP0.4 150.81,5.2 151,5.39 R57.1 150,6.45 150,8.2 148.9,9.3 141.1,17.1 U10.16
CHIP1_RES
  Top 0.254: 129.5,4.95 130.04,4.41 | 130.04,4.41 CHIP1.3 | 129.5,4.95 130.04,4.41 | U10.13 139.15,16.95 130.5,8.3 130.5,6.3 129.65,5.45 R64.1 129.5,4.95
CHIP1_STATUS  (via drill 0.35)
  Top 0.254: U6.23 119.75,49.55 121.56,47.73 v121.56,47.66
  Bottom 0.254: v121.56,47.66 121.77,47.47 121.77,31.34 128.7,24.4 128.7,1.87 CHIP1.2
CHIP1_TH
  Top 0.254: CHIP1.4 131.31,5.26 R62.1 132.7,6.65 132.7,9.75 139.8,16.85 U10.14
CHIP2_RES
  Top 0.254: CHIP2.3 110.54,4.41 110,4.95 R68.1 111.1,6.55 111.1,8.6 113.69,11.19 131.87,11.19 137.88,17.2 137.88,18.47 U10.11
CHIP2_STATUS  (via drill 0.35)
  Top 0.254: U6.16 116.25,50.45 113.9,48.1 113.9,47.1 113.9,36.9 v114.4,36.4
  Bottom 0.254: v114.4,36.4 114.4,8.4 109.27,3.27 CHIP2.2
CHIP2_TH
  Top 0.254: 111.9,5.35 111.9,5.29 111.81,5.2 CHIP2.4 | R66.1 117.25,10.7 132.1,10.7 138.5,17.1 U10.12
  Top 0.508: R66.1 111.9,5.35
CHIP3_RES
  Top 0.254: CHIP3.3 90.54,4.51 90,5.05 R72.1 91,6.45 91,8 95.2,12.2 131.2,12.2 136.55,17.55 U10.9
CHIP3_STATUS  (via drill 0.35)
  Top 0.254: U6.15 115.75,50.55 113.3,48.1 v113.3,36.4
  Bottom 0.254: v113.3,36.4 113.3,25.83 CHIP3.2
CHIP3_TH
  Top 0.254: CHIP3.4 91.8,5.25 R70.1 92.55,5.45 93.7,6.6 93.7,8.3 97.1,11.7 131.6,11.7 137.2,17.3 U10.10
CHIP4_RES
  Top 0.254: CHIP4.3 70.04,4.91 R59.1 70.5,6.45 70.5,7.9 76.6,14 99.1,14 102.7,17.6 U9.15
CHIP4_STATUS  (via drill 0.35)
  Top 0.254: U6.12 113.25,53.3 112.7,53.3 103.5,44.1 103.5,42.1 v103.1,41.7
  Bottom 0.254: v103.1,41.7 102.4,41 102,41 68.77,7.77 CHIP4.2
CHIP4_TH
  Top 0.254: 71.3,5.25 CHIP4.4 | U9.16 103.35,17.45 99.4,13.5 79.6,13.5 71.55,5.45 R55.1
  Top 0.508: R55.1 71.3,5.25
CHIP5_RES
  Top 0.254: CHIP5.3 50.04,4.91 R63.1 50.6,6.55 50.6,8 50.6,8.2 57.4,15 98.52,15 101.43,17.91 101.43,20.22 U9.13
CHIP5_STATUS  (via drill 0.35)
  Top 0.254: U6.11 113.27,53.78 112.46,53.78 102.9,44.22 102.9,42.7 v102,41.8
  Bottom 0.254: CHIP5.2 71.47,24.5 84.6,24.5 101.7,41.6 101.8,41.6 v102,41.8
CHIP5_TH
  Top 0.254: CHIP5.4 51.3,5.25 R61.1 60.54,14.49 98.79,14.49 102.08,17.78 102.08,20.22 U9.14
CHIP6_RES
  Top 0.254: CHIP6.3 30.04,4.16 29.5,4.7 R67.1 30.5,6.45 30.5,7.6 38.9,16 97.97,16 100.13,18.16 100.13,20.22 U9.11
CHIP6_STATUS  (via drill 0.35)
  Top 0.254: U6.38 119.75,57.6 v119.6,57.6
  Bottom 0.254: v119.6,57.6 119.6,45.4 119.6,45 117.1,42.5 101.72,42.5 84.22,24.99 51.96,24.99 CHIP6.2
CHIP6_TH
  Top 0.254: CHIP6.4 31.3,5.25 R65.1 31.65,5.45 33.6,7.4 33.6,9.9 39.2,15.5 40.8,15.5 98.25,15.5 100.78,18.03 100.78,20.22 U9.12
CHIP7_RES
  Top 0.254: CHIP7.3 10.04,3.91 9.5,4.45 R71.1 10.6,6.55 10.6,8.1 12.62,10.12 31.47,10.12 38.45,17.1 97.6,17.1 98.8,18.3 U9.9
CHIP7_STATUS  (via drill 0.35)
  Top 0.254: U6.39 119.25,58.5 118.55,57.8 v118.5,57.8
  Bottom 0.254: v118.5,57.8 118.5,56.8 119.09,56.21 119.09,45.19 116.91,43.01 101.46,43.01 84.05,25.6 51.7,25.6 35.99,9.9 15.2,9.9 8.77,3.47 CHIP7.2
CHIP7_TH
  Top 0.254: R69.1 11.5,5.41 | 11.5,5.41 11.31,5.22 CHIP7.4 | U9.10 99.45,18.25 97.7,16.5 38.62,16.5 31.73,9.61 15.7,9.61 11.5,5.41
DAC
  Top 0.254: U6.3 111.53,57.75 111.17,58.11 105.2,58.11 | 105.2,58.11 104.3,58.11 | 105.2,58.11 104.29,58.11 TP1.TP
EN  (via drill 0.35)
  Top 0.203: U1.12 22.53,67.57 22.53,66.47 22.7,66.29 v22.7,66
  Top 0.254: U5.12 22.5,50.65 22.7,50.45 v22.7,49.4 | U11.12 22.5,16.55 v22.65,16.4 | U8.12 22.5,32.95 v22.65,32.8 | Q1.3 50.85,42.2 50.05,41.4 R5.2 48.3,41.45 v46.2,41.45
  Bottom 0.254: v22.65,16.4 22.65,16.6 22.65,29 | 22.65,29 22.65,32.55 v22.65,32.8 22.65,49.35 v22.7,49.4 v22.7,66 | 22.65,29 33.7,29 46.15,41.45 v46.2,41.45
GND  (via drill 0.35)
  Top 0.254: U1.2 23,72.35 C4.2 | 24.85,74.2 R24.1 | 24.85,57.7 R40.1 | U5.2 23,55.85 C20.2 | U11.2 23,23.05 C46.2 23.15,23.5 | U8.2 23,39.35 C37.2 | U6.35 123.9,58.25 124.5,58.85 C33.2 | v36,35 36.76,35.76 U4.10 | 101.5,25.75 U9.4 101.45,28.45 v101.6,28.6 | v138.41,27.5 139.21,26.7 U10.4 | C49.2 145,58.1 v144.4,57.5 | U6.18 117.25,48.1 C32.2 | U6.5 110.76,56.75 v110.6,56.91 | C6.2 v110.5,62.64 | U6.42 117.75,62.25 118.6,63.1 119.7,63.1 120.1,63.5 120.1,65.4 119.65,65.85 C27.2 | C34.2 117.1,66.7
  Top 0.508: R40.1 27.5,58 29.5,56 v30.5,56 | C4.2 24.85,74.2 R24.1 27,74.5 29,72.5 v30,72.5 | 24.85,57.7 23,55.85 | C37.2 24.85,41.2 R53.1 26.5,41.5 28.5,39.5 v30.5,39.5 | v30.5,23.5 29.5,23.5 28,25 25.05,25 R74.1 23.15,23.5 | R5.1 48.35,47.5
  Bottom 1.016: v30,72.5 30.5,72.5 v30.5,56 30.5,47.9 | 30.5,47.9 v30.5,39.5 v30.5,30 32.7,30 36,33.3 v36,35 | 30.5,47.9 v30.5,47.5 43.75,47.5 v44.75,48.5 v46.75,48.5 v48.75,48.5 v50.75,48.5 v52.75,48.5
  other vias: 47.1,31 31.5,30 32.5,30 42.75,49 42.75,47.5 44.75,50 44.75,47 46.75,50 46.75,47 48.75,50 48.75,47 50.75,50 50.75,47 52.75,47 52.75,50 54.75,49 54.75,47.5 109.25,47.8 117.5,56 122,60.5 113,60.5 113,63 121,65 123.5,70 113,69 108.5,74.8 99.5,74.8 90.5,74.8 94.5,69.8 103.5,70 84.5,71 30.5,50 30.5,13 1.5,10.5 21,5.5 41.5,5.5 62.5,5.5 83.5,5.5 103,5 122,4.5 141,4 149.5,21 122.5,21 104.5,15.5 125.5,41.5 125.5,35 118,34.5 106,28 97,27 97,19 72.5,19 54.5,19 63,39.5 56.5,40 56.5,36 63.5,34.5 18,11 36,39.5 55,43.5 48.5,40 72,43 82,43
  pour Layer3 (rank 2, no thermals): -3.3,82.1 -3.3,-3.4 161.2,-3.4 161.2,82.1
  pour Top (no thermals): 41.5,50.5 56,50.5 56,46.5 41.5,46.5
  pour Top (rank 2): -6,11.5 29.7,11.5 29.7,50.6 80.5,50.6 81.1,51.2 81.1,79.9 81,80 81,84.5 165.5,84.5 165.5,-5.5 -6,-5.5
  pour Bottom (no thermals): -2.2,81.9 163.5,81.9 163.5,-6.1 -2.2,-6.1
GNDA  (via drill 0.35)
  Top 0.152: C12.2 19.05,74.45
  Top 0.508: C12.2 19.05,74.45
  Top 1.016: C30.2 76.5,78 J2.3 69.8,78 J2.2
  Bottom 0.508: TP6.P$1 69.5,69.25 v69.75,69.5
  other vias: 16.25,69.5 16.25,68 17.75,69 19.25,69 24.75,69 27.75,69 26.25,69 26.25,67.5 26.25,70.5 27.75,70.5 27.75,67.5 16.25,63 16.25,64.5 17.75,64.5 17.75,63 17.75,66 16.25,72.5 16.25,74.5 17.75,74.5 17.75,72.5 16.25,58 17.75,58 16.25,56 17.75,56 16.25,53.5 16.25,51.5 17.25,52.5 18.75,52.5 24.75,52.5 26.25,52.5 27.75,52.5 26.25,54 27.75,54 26.25,51 27.75,51 16.25,47 17.75,47 17.75,48.5 16.25,48.5 17.75,50 17.75,41.5 16.25,41.5 16.25,39.5 17.75,39.5 19.25,36 16.25,36.5 16.25,34.5 17.75,36 24.75,36 26.25,36 27.75,36 26.25,37.5 27.75,37.5 27.75,34.5 26.25,34.5 18.25,33 18.25,31 16.25,31 17.75,25.5 17.75,23.5 16.25,23.5 16.25,25.5 24.75,19.5 26.25,19.5 27.75,19.5 27.75,21 26.25,21 26.25,18 27.75,18 19.25,19.5 17.75,19.5 16.25,20 16.25,18.5 18.25,16.5 18.25,14.5 16.25,14.5 42.25,63 42.25,59 42.25,61 42.25,57 44.25,57 44.25,59 44.25,61 46.25,61 46.25,63 44.25,63 48.25,61 42.25,71.5 42.25,73.5 44.25,73.5 44.25,71.5 46.25,71.5 46.25,73.5 48.25,73.5 48.25,71.5 53.75,68 54.25,69 54.25,70 54.25,71.5 71.25,69.5 72.25,59 69.75,59 69.75,56.5 72.25,56.5 69.75,54 66.25,56.5 66.25,54 63.75,54 63.75,56.5 61.25,56.5 61.25,54 61.25,59 63.75,59 66.25,59 66.25,61.5 63.75,61.5 61.25,61.5 61.25,51.5 63.75,51.5 66.25,51.5 42.75,53.5 54.25,53.5 87,65.5 85,65.5 87,64 85,64 89.6,55.7 89.5,53 87.5,53 85.5,53 83.1,65.5 83.1,64 82.5,53 82.5,55.5
  pour Top (no thermals): 50.95,68.6 53.15,68.6 53.6,69.05 53.6,71.85 55.15,71.85 55.15,68.45 54.5,67.8 50.95,67.8
  pour Top (no thermals): 15.55,70.25 19.5,70.25 20.05,69.7 23.95,69.7 25.6,71.35 29.05,71.35 29.1,71.4 29.1,66.4 25.75,66.4 23.85,68.3 20.15,68.3 20.1,68.25 17.65,68.25 15.65,66.25 15.55,66.35
  pour Top (no thermals): 15.55,64.55 15.55,62.5 19.5,62.5 20.3,63.3 20.3,66.65 20.25,66.7 17.7,66.7
  pour Top (no thermals): 15.55,71.6 15.55,75.6 19.3,75.6 19.7,75.2 19.7,71.8 19.5,71.6
  pour Top (no thermals): 15.55,55.3 15.55,59.15 19.25,59.15 19.9,58.5 19.9,55.3
  pour Top (no thermals): 15.55,54.1 15.55,49.55 17.8,51.8 23.85,51.8 25.8,49.85 29,49.85 29,55.15 25.8,55.15 23.85,53.2 20.25,53.2 19.35,54.1
  pour Top (no thermals): 15.55,48.65 17.25,50.35 20.2,50.35 20.2,46.85 19.65,46.3 15.55,46.3
  pour Top (no thermals): 15.55,42.85 19.15,42.85 20.15,41.85 20.15,38.6 20.1,38.55 15.55,38.55
  pour Top (no thermals): 15.55,37.25 15.55,33.15 17.7,35.3 23.95,35.3 25.9,33.35 29.2,33.35 29.2,38.4 24.98,38.4 23.82,36.7 20.05,36.7 19.72,37.25
  pour Top (no thermals): 15.55,31.6 15.55,29.65 19.4,29.65 20.25,30.5 20.25,33.7 17.65,33.7
  pour Top (no thermals): 15.55,26.3 19.4,26.3 19.9,25.8 19.9,22.25 19.8,22.15 15.55,22.15
  pour Top (no thermals): 15.55,20.55 19.9,20.55 20.05,20.4 23.85,20.4 25.4,21.95 29.45,21.95 29.45,17.2 25.5,17.2 23.7,19 17.6,19 15.55,16.95
  pour Top (no thermals): 15.55,15.45 17.85,17.75 20.2,17.75 20.2,13.65 19.8,13.25 19.75,13.2 15.55,13.2 15.55,15.4
  pour Layer3 (no thermals): -2,81 82,81 82,50.9 29.5,50.9 29.5,12 -2,12
  pour Top (no thermals): 41.5,74 48.5,74 50.5,72 50.5,66.5 49.5,65.5 49.5,56.5 49,56 41.5,56
  pour Top (no thermals): 68.5,69 69.5,70 72,70 72,63.5 73.3,62.2 73.3,53.8 72.3,52.8 72.3,51 60.5,51 60.5,62 66.4,62 68.5,64.1
  pour Top: 41.5,51.2 41.5,56.5 61,56.5 61,51.2
  pour Layer3 (no thermals): 81.6,51 92.2,51 92.2,66.8 81.6,66.8
  pour Top (no thermals): 81.5,66.4 90.7,66.4 91.7,65.4 91.7,63.7 89.1,61.1 81.5,61.1
  pour Top: 81.5,56.3 89.4,56.3 89.9,56.8 91.6,56.8 91.6,53.6 90.3,52.3 81.5,52.3
LDAC
  Top 0.254: U6.9 112.13,54.75 99.63,42.25 52.4,42.25 47.41,37.26 U4.4
MISO  (via drill 0.35)
  Top 0.254: U6.28 135,54.75 135.6,54.75 141,60.15 v141,67.9 | v148,68.2 148,73.04 SD1.7
  Bottom 0.254: v141,67.9 141.1,68 147.8,68 v148,68.2 149.3,69.5 TP14.P$1
MOSI  (via drill 0.35)
  Top 0.254: U6.25 139.75,53.25 v140,53 | v143.66,65.5 143.7,65.54 v143.7,71.3 SD1.3
  Bottom 0.254: v140,53 143.66,56.66 v143.66,65.5 | TP13.P$1 143.7,70.7 v143.7,71.3
N$1
  Top 0.254: R45.1 137.9,25.15 U10.6
N$2
  Top 0.254: U9.6 100.1,25.75 100.1,27.5 98.2,29.4 R44.1
N$3
  Top 0.254: R48.2 133.4,27.65 134.5,27.65 137.25,24.9 U10.7
N$4
  Top 0.254: U10.8 136.6,24.05 136.6,24.75 134.2,27.15 131.9,27.15 R51.2
N$5
  Top 0.254: R46.2 96.2,30.15 96.9,29.45 97.55,29.45 99.5,27.5 U9.7
N$6
  Top 0.254: R49.2 95.55,29 97.3,29 98.9,27.4 98.9,25.75 U9.8
N$8
  Top 0.254: R18.1 107.35,70.35 105.1,72.6 RESET.A RESET.A'
N$10  (via drill 0.35)
  Top 0.254: R35.2 86.25,54.65 v86.25,54 | U7.3 v90.95,54
  Bottom 0.254: v90.95,54 v86.25,54
N$11
  Top 0.508: JP1.1 157.31,47.5 R11.1 R12.1
N$13
  Top 0.254: X2.P$1 108.85,59.85 C6.1 110.5,59.55 111.8,58.25 U6.2
N$14
  Top 0.254: C8.1 106.85,61.9 X2.P$2 108.5,62.6 109.4,63.5 111,63.5 111.8,62.7 111.8,59.05 112.1,58.75 U6.1
N$15
  Top 0.254: C7.1 110.05,57.7 110.9,57.7 111.35,57.25 U6.4
N$16
  Top 0.254: C27.1 118.6,64.15 117.25,62.8 U6.43
N$17
  Top 0.254: R20.1 100.5,61.55 LED1.A
N$18
  Top 0.508: R13.1 153.85,44.5 | 153.85,44.5 R14.1 | JP1.2 157.23,44.5 153.85,44.5
N$19
  Top 0.254: R26.1 27.5,76.5 R28.2 R29.2
N$20
  Top 0.254: R24.2 23.15,74.8 | 23.15,74.8 R26.2 R23.1 | U1.3 22.5,71.2 22.2,71.5 22.2,73.9 23.1,74.8 23.15,74.8
N$21
  Top 0.254: U1.1 23.5,71 24.85,72.35 C4.1
N$22
  Top 0.508: L1.1 17.8,67.6 U1.8
  pour Top (no thermals): 20.4,67.9 21.05,67.9 21.05,67.3 20.4,67.3
N$23
  Top 0.508: R23.2 20.95,74.7 C12.1 | C16.1 21.1,72.35 21.1,71.5 21.7,70.9
  Top 0.61: TEC4.2 10.5,76.5 R23.2 | C12.1 C16.1
  pour Top (no thermals): 21.45,70.9 21.45,70.1 22.05,70.1 22.05,70.9
N$24
  Top 0.508: L1.2 14.7,70.9 20,70.9 U1.7
  pour Top (no thermals): 20.5,70.7 21.1,70.7 21.1,70.1 20.5,70.1
N$25
  Top 0.254: R41.1 R43.2 R42.2
N$26
  Top 0.254: U5.1 23.5,54.7 24.8,56 C20.1
N$27
  Top 0.254: U3.2 67.28,61.83 65.8,63.3 65.8,67.3 66.5,68 R30.1
N$28
  Top 0.254: U5.3 22.5,54.5 22.2,54.8 22.2,57.2 23,58 R40.2 R41.2 R39.1
N$29
  Top 0.254: 20.95,58.2 C31.1
  Top 0.508: R39.2 20.95,58.2 C31.1 C28.1 20.95,55.3 21.72,54.53 21.72,53.9
  Top 0.61: TEC3.2 10.5,60 R39.2
  pour Top (no thermals): 21.45,54.2 22.05,54.2 22.05,53.65 21.45,53.65
N$30
  Top 0.61: L2.1 14,47.8 17.3,51.1 U5.8
  pour Top (no thermals): 20.5,51.4 21,51.4 21,50.8 20.5,50.8
N$31
  Top 0.61: L2.2 14.9,54.6 19.8,54.6 U5.7
  pour Top (no thermals): 20.5,54.2 21,54.2 21,53.7 20.5,53.7
N$32
  Top 0.254: U4.5 44.29,38.75 R25.1
N$33
  Top 0.254: R54.1 R56.2 R58.2
N$34
  Top 0.254: U8.1 23.5,38.15 C37.1
N$35
  Top 0.254: U8.3 22.5,38.5 22.2,38.8 22.2,40.55 R53.2 R54.2 R52.1
N$36
  Top 0.254: 21.8,38.2 21.8,37.47
  Top 0.508: R52.2 20.95,41.7 C43.1 20.95,39 C42.1 20.95,39.05 21.8,38.2 21.8,37.47 21.87,37.4
  Top 0.61: TEC2.2 10,43.5 R52.2
  pour Top (no thermals): 21.45,37.9 21.45,37.1 22.05,37.1 22.05,37.9
N$37
  Top 0.61: L4.1 17.8,34.6 U8.8
  pour Top (no thermals): 20.2,34.9 21.05,34.9 21.05,34.1 20.2,34.1
N$38
  Top 0.61: L4.2 14.7,37.9 20,37.9 U8.7
  pour Top (no thermals): 20.2,37.9 21.05,37.9 21.05,37.1 20.2,37.1
N$39
  Top 0.508: R34.2 76.94,60.41 74.61,60.41 U3.5 | Q6.1 Q6.2 Q6.3
  Top 1.016: R34.2 77.1,60.48 78.06,59.51 Q6.3 Q6.1
N$40
  Top 0.254: R75.1 30.25,27.2 R76.2 R77.2
N$41
  Top 0.254: U3.1 68.28,62.48 C23.1 R33.2
N$42
  Top 0.254: C24.1 69.3,49.75 R32.1 C25.1
N$43  (via drill 0.35)
  Top 0.254: U3.3 v68.5,61.17 | v67.6,53 67.6,51.85 R38.1 C24.2 69.25,48.1 R37.2
  Bottom 0.254: v68.5,61.17 68.5,53.9 v67.6,53
N$44
  Top 0.254: U11.1 23.5,21.85 C46.1
N$45
  Top 0.254: R73.1 R75.2 R74.2 22.32,24.37 22.32,22.18 22.5,22 U11.3
N$46
  Top 0.254: U3.7 74.6,61.92 78.67,61.92 80,60.6 C22.2
N$47
  Top 0.508: R73.2 20.95,25.4 C48.1 C47.1 20.95,22.65 21.75,21.85 21.75,21
  Top 0.61: TEC1.2 9.7,27.2 R73.2
  pour Top (no thermals): 21.45,21.4 22.05,21.4 22.05,20.8 21.45,20.8
N$48
  Top 0.61: L5.1 17.8,18.3 U11.8
  pour Top (no thermals): 20.5,18.6 21,18.6 21,18 20.5,18
N$49
  Top 0.61: L5.2 14.2,21.1 U11.7
  pour Top (no thermals): 20.5,21.4 21.05,21.4 21.05,20.8 20.5,20.8
N$50
  Top 0.508: R32.2 72.85,49.85 72.85,55 74.35,56.5 D2.2
  Top 1.016: D2.2 74.4,55
  pour Top (no thermals): 73.8,57.35 80.9,57.35 80.99,50.05 76.55,50.05 76.55,53.95 73.8,53.95
  pour Top (no thermals): 74.3,57.35 81.1,57.35 81.19,50.05 77.05,50.05 77.05,53.95 74.15,53.95 74.15,57.2
N$51  (via drill 0.35)
  Top 0.254: Q6.4 76.8,58.9 76.3,59.4 v75.75,59.4 | U3.6 75.53,61.17 v75.6,61.25
  Bottom 0.254: v75.6,61.25 75.75,61.1 v75.75,59.4
N$52
  Top 0.254: U12.4 46.03,65.5 R82.1
N$53
  Top 0.254: R80.2 45.22,68.14 U12.2
N$54
  Top 0.254: R81.2 44.55,66.8 46.06,66.8 U12.3
N$55
  Top 0.254: C50.1 51.9,63.5 51.9,65.57 U12.5
  pour Top (no thermals): 50.35,65.75 55.5,65.75 56.5,64.75 56.5,57.25 50.35,57.25
OUT1
  Top 0.508: U12.6 51.96,66.95 55.5,66.95
  Top 1.27: TEC5.2 56.2,72.8 56.2,67.65 55.5,66.95
  pour Top (no thermals): 50.95,67.3 50.95,66.45 55.4,66.45 55.4,67.3
OUT2
  Top 0.254: U12.8 51.85,69.43 51.85,72.15
  Top 1.27: TEC5.1 51.85,72.15
  pour Top (no thermals): 51.95,69.4 52.85,69.4 52.85,72.1 50.95,72.1 50.95,69.45 51,69.4
PWM_0  (via drill 0.35)
  Top 0.254: U6.7 111.12,55.75 v110.92,55.55 | R28.1 35.15,76.5 v40.65,71 R80.1
  Bottom 0.254: v110.92,55.55 103.57,62.9 47.85,62.9 41.75,69 41.75,69.9 v40.65,71
PWM_1  (via drill 0.35)
  Top 0.254: R43.1 v33,60 | v40.35,67.35 40.5,67.5 R81.1 | U6.8 111.95,55.25 111.25,54.55 v110.68,54.55
  Bottom 0.254: v33,60 35.25,62.25 | 35.25,62.25 v40.35,67.35 | 35.25,62.25 35.3,62.3 102.88,62.3 110.63,54.55 v110.68,54.55
PWM_2  (via drill 0.35)
  Top 0.254: R56.1 v32.84,43.5 | U6.19 117.75,46.06 v116.65,44.96
  Bottom 0.254: v32.84,43.5 45.36,43.5 47,41.86 98.55,41.86 100.75,44.06 115.75,44.06 v116.65,44.96
PWM_3  (via drill 0.35)
  Top 0.254: R76.1 v33.1,27.1 | v116.75,43.9 118.28,45.43 118.28,51.77 U6.20
  Bottom 0.254: v33.1,27.1 34.1,26.1 83.75,26.1 101.15,43.5 116.35,43.5 v116.75,43.9
SCK  (via drill 0.35)
  Top 0.254: U6.26 141.75,53.75 145.9,57.9 v145.9,71 SD1.5
  Bottom 0.254: TP15.P$1 145.9,70.6 v145.9,71
SCL_1  (via drill 0.35)
  Top 0.254: U6.32 125.7,56.75 126.5,57.55 v126.5,57.6 127.3,58.4 R47.1 | 124.5,44.8 109.8,30.1 104.9,30.1 102.1,27.3 U9.3 | 124.5,44.8 v124.6,44.9 | U10.3 139.85,31.05 126.1,44.8 124.5,44.8
  Bottom 0.254: 126.65,47.35 126.7,47.4 126.7,57.4 v126.5,57.6 | 126.65,47.35 125.9,46.6 124.6,45.3 v124.6,44.9 | TP8.P$1 126.5,47.5 126.65,47.35
SCL_2  (via drill 0.35)
  Top 0.254: v138.5,44.3 139.2,43.6 139.95,43.6 R8.1 140.06,43.59 Q3.2 142.11,43.59 143.06,44.53 143.06,45.06 144.2,46.2 151.45,46.2 R13.2 | v137.2,47.3 136.81,46.91 120.09,46.91 119.25,47.75 U6.22
  Bottom 0.254: v138.5,44.3 138.5,46 v137.2,47.3 136.8,47.7 TP10.P$1
SCL_2_H
  Top 0.254: Q3.3 144.88,43.65 R19.1 152,43.65 R14.2
SCL_3  (via drill 0.35)
  Top 0.152: 63.58,37.92 v63.83,38.17
  Top 0.254: Q2.2 60.69,35.16 R7.1 63.58,37.92 | v63.83,38.17 66.14,40.49 104.99,40.49 115.25,50.75 U6.14
  Bottom 0.254: TP12.P$1 67.3,34.7 v63.83,38.17
SCL_3_H
  Top 0.254: U4.2 53.61,36.24 R16.1 55.6,34.25 Q2.3
SDA_1  (via drill 0.35)
  Top 0.254: v124.4,43.7 124.35,43.7 110.25,29.6 105.15,29.6 102.75,27.2 U9.2 | U6.31 127.05,56.25 v128.4,57.6 129.3,58.5 R50.1 | U10.2 140.5,30.98 126.2,45.27 v126.2,45.5
  Bottom 0.254: v124.4,43.7 v126.2,45.5 126.2,45.6 128.4,47.8 128.4,51 | 128.4,51 v128.4,57.6 | TP7.P$1 128.5,51.1 128.4,51
SDA_2  (via drill 0.35)
  Top 0.254: R11.2 147.9,47.5 147.2,46.8 144.4,46.8 143.62,47.59 Q5.2 141.91,47.65 140.9,47.65 | 140.9,47.65 R6.1 v138.7,47.65 | v138.7,47.65 140.9,47.65 | v138.7,47.65 137.53,46.48 137.4,46.35 119.9,46.35 118.75,47.5 U6.21
  Bottom 0.254: TP9.P$1 135.15,51.2 v138.7,47.65
SDA_2_H
  Top 0.254: R12.2 146.15,49.5 R15.1 144.88,49.35 Q5.3
SDA_3  (via drill 0.35)
  Top 0.254: Q4.2 60.69,39.16 R4.1 v62.08,40.42 62.12,40.42 62.6,40.9 104.55,40.9 114.75,51.1 U6.13
  Bottom 0.254: TP11.P$1 66,38.2 63.77,40.42 v62.08,40.42
SDA_3_H
  Top 0.254: U4.3 53.7,36.75 54.35,37.4 R10.1 55.6,38.25 Q4.3
SERIAL_NUM_1W  (via drill 0.35)
  Top 0.254: U6.29 127.7,55.25 130.45,55.25 v131,55.8 133.3,58.1 R21.1 | CHIP7.5 13.54,0.83 32.58,0.83 | CHIP0.5 152.08,1.72 151.2,0.83 132.58,0.83 | 52.6,0.83 52.62,0.83 72.58,0.83 | 93.1,0.83 113.08,0.83 | 132.58,0.83 113.5,0.83 113.08,0.83 | CHIP1.5 132.58,0.83 | CHIP2.5 113.08,0.83 | CHIP3.5 93.08,0.83 | 93.08,0.85 93.1,0.83 | CHIP4.5 72.58,0.83 | CHIP5.5 52.6,1.78 52.6,0.83 | CHIP6.5 32.58,0.83 | 93.08,0.83 72.58,0.83 | 93.08,0.83 93.1,0.83 | 32.58,0.83 52.6,0.83
  Bottom 0.254: CHIP0.5 152.08,2.62 131,23.7 v131,55.8
SWCLK
  Top 0.254: DEBUG.4 118.45,73.64 R22.1 118.45,68.75 116.25,66.55 U6.45
  Bottom 0.254: DEBUG.4 120.37,74.57 TP18.P$1
SWDIO  (via drill 0.35)
  Top 0.254: U6.46 115.75,67.15 v117.7,69.1
  Bottom 0.254: v117.7,69.1 119.9,69.1 122,71.2 TP17.P$1 121.64,71.86 DEBUG.2
TEC_EN
  Top 0.254: Q1.1 62.38,41.3 62.38,41.31 99.36,41.31 112.31,54.25 U6.10
USBD_N
  Top 0.254: USB.D- 130.45,71.88 126.3,67.72 126.3,58.33 125.27,57.29 122.6,57.29 122.56,57.25 U6.33
USBD_P
  Top 0.254: USB.D+ 129.8,71.8 125.89,67.89 125.89,58.49 125.1,57.7 122.6,57.7 122.55,57.75 U6.34
VCC
  Top 0.508: JP1.3 154.88,42.23 C1.1 R3.2 R1.2
VDAC_0
  Top 0.254: U4.6 35.8,37.74 33.91,39.63 33.91,60.39 31.85,62.45 R29.1
VDAC_1
  Top 0.254: U4.7 35.6,37.26 33.5,39.36 33.5,56.35 R42.1
VDAC_2
  Top 0.254: U4.8 35.45,36.75 31.65,40.55 R58.1
VDAC_3
  Top 0.254: U4.9 39.18,36.2 34.99,36.2 33.85,35.06 33.85,26.9 R77.1
VREG_IN
  pour Top: 81.5,60.7 90.2,60.7 91.65,59.25 91.65,57.3 91.5,57.15 89.6,57.15 89.1,56.65 81.5,56.65

## Text on the board
bPlace: Easy Check rev 1 / 2019/04/30